# Altium schematic sheet Main_Sheet.SchDoc
size A4
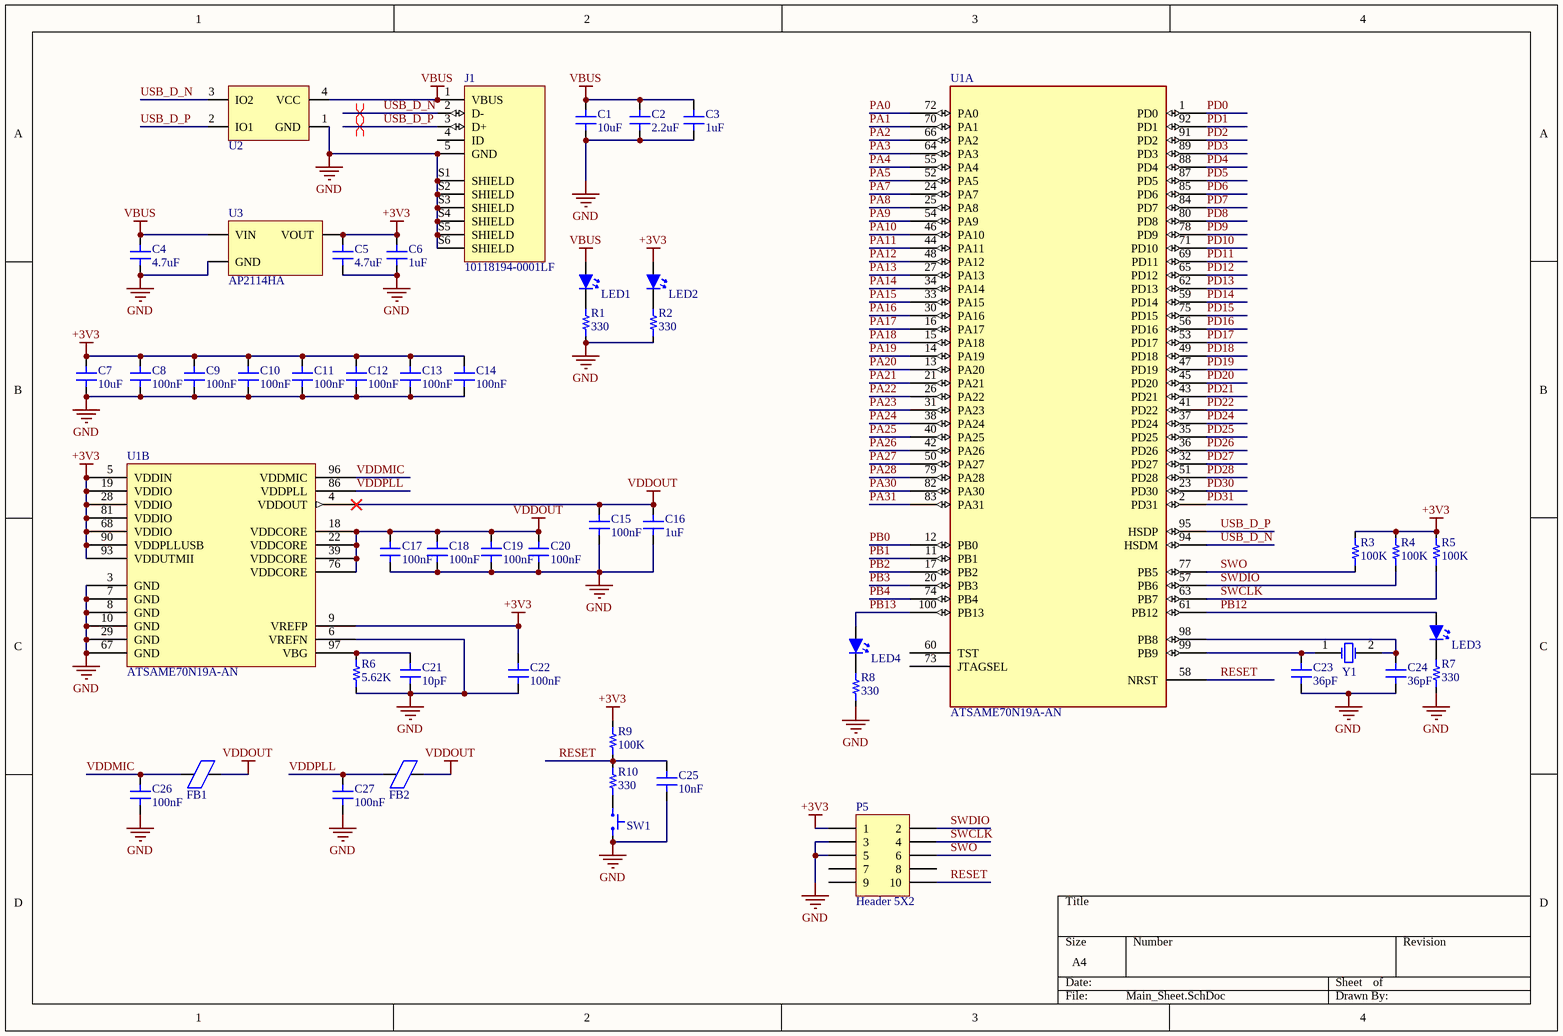
[diagram p0: Main_Sheet.SchDoc]

## Parts
C1  value 10uF  [C0603]  (hidden comment: Cap)
C2  value 2.2uF  [C0603]  (hidden comment: Cap)
C3  value 1uF  [C0603]  (hidden comment: Cap)
C4  value 4.7uF  [C0603]  (hidden comment: Cap)
C5  value 4.7uF  [C0603]  (hidden comment: Cap)
C6  value 1uF  [C0603]  (hidden comment: Cap)
C7  value 10uF  [C0603]  (hidden comment: Cap)
C8  value 100nF  [C0603]  (hidden comment: Cap)
C9  value 100nF  [C0603]  (hidden comment: Cap)
C10  value 100nF  [C0603]  (hidden comment: Cap)
C11  value 100nF  [C0603]  (hidden comment: Cap)
C12  value 100nF  [C0603]  (hidden comment: Cap)
C13  value 100nF  [C0603]  (hidden comment: Cap)
C14  value 100nF  [C0603]  (hidden comment: Cap)
C15  value 100nF  [C0603]  (hidden comment: Cap)
C16  value 1uF  [C0603]  (hidden comment: Cap)
C17  value 100nF  [C0603]  (hidden comment: Cap)
C18  value 100nF  [C0603]  (hidden comment: Cap)
C19  value 100nF  [C0603]  (hidden comment: Cap)
C20  value 100nF  [C0603]  (hidden comment: Cap)
C21  value 10pF  [C0603]  (hidden comment: Cap)
C22  value 100nF  [C0603]  (hidden comment: Cap)
C23  value 36pF  [C0603]  (hidden comment: Cap)
C24  value 36pF  [C0603]  (hidden comment: Cap)
C25  value 10nF  [C0603]  (hidden comment: Cap)
C26  value 100nF  [C0603]  (hidden comment: Cap)
C27  value 100nF  [C0603]  (hidden comment: Cap)
FB1  Ferrite Bead  [C0603]  (value not drawn)
FB2  Ferrite Bead  [C0603]  (value not drawn)
J1  10118194-0001LF  [AMPHENOL_10118194-0001LF]
LED1  LED  [LED0805]  (value not drawn)
LED2  LED  [LED0805]  (value not drawn)
LED3  LED  [LED0805]  (value not drawn)
LED4  LED  [LED0805]  (value not drawn)
P5  Header 5X2  [IPC_5X2_1.27MM]
R1  value 330  [R0603]  (hidden comment: Res)
R2  value 330  [R0603]  (hidden comment: Res)
R3  value 100K  [R0603]  (hidden comment: Res)
R4  value 100K  [R0603]  (hidden comment: Res)
R5  value 100K  [R0603]  (hidden comment: Res)
R6  value 5.62K  [R0603]  (hidden comment: Res)
R7  value 330  [R0603]  (hidden comment: Res)
R8  value 330  [R0603]  (hidden comment: Res)
R9  value 100K  [R0603]  (hidden comment: Res)
R10  value 330  [R0603]  (hidden comment: Res)
SW1  Button  [TL3305]  (value not drawn)
U1  ATSAME70N19A-AN  [TQFP100_14x14MC_MCH]  (parts A,B of 2)
U2  5.5V TVS Diode  [SOT143]  (value not drawn)
U3  AP2114HA  [SOT230P700X180-4N]
Y1  XTAL  [SMD-4]  (value not drawn)

## Nets
+3V3: C5.1 C6.1 C7.2 C8.2 C9.2 C10.2 C11.2 C12.2 C13.2 C14.2 C22.1 LED2.1(A) P5.1 R3.1 R4.1 R5.1 R9.1 U1.5(VDDIN) U1.9(VREFP) U1.19(VDDIO) U1.28(VDDIO) U1.68(VDDIO) U1.81(VDDIO) U1.90(VDDPLLUSB) U1.93(VDDUTMII) U3.3(VOUT)
GND: C1.2 C2.2 C3.2 C4.2 C5.2 C6.2 C7.1 C8.1 C9.1 C10.1 C11.1 C12.1 C13.1 C14.1 C15.2 C16.2 C17.2 C18.2 C19.2 C20.2 C21.2 C22.2 C23.1 C24.1 C25.2 C26.1 C27.1 J1.5(GND) J1.S1(SHIELD) J1.S2(SHIELD) J1.S3(SHIELD) J1.S4(SHIELD) J1.S5(SHIELD) J1.S6(SHIELD) P5.3 P5.5 R1.2 R2.2 R6.2 R7.2 R8.2 SW1.1 U1.3(GND) U1.6(VREFN) U1.7(GND) U1.8(GND) U1.10(GND) U1.29(GND) U1.67(GND) U2.1(GND) U3.2(GND)
VBUS: C1.1 C2.1 C3.1 C4.1 J1.1(VBUS) LED1.1(A) U2.4(VCC) U3.1(VIN)
VDDOUT: C15.1 C16.1 C17.1 C18.1 C19.1 C20.1 FB1.2 FB2.2 U1.4(VDDOUT) U1.18(VDDCORE) U1.22(VDDCORE) U1.39(VDDCORE) U1.76(VDDCORE)
PA0: U1.72(PA0)
PA1: U1.70(PA1)
PA2: U1.66(PA2)
PA3: U1.64(PA3)
PA4: U1.55(PA4)
PA5: U1.52(PA5)
PA7: U1.24(PA7)
PA8: U1.25(PA8)
PA9: U1.54(PA9)
PA10: U1.46(PA10)
PA11: U1.44(PA11)
PA12: U1.48(PA12)
PA13: U1.27(PA13)
PA14: U1.34(PA14)
PA15: U1.33(PA15)
PA16: U1.30(PA16)
PA17: U1.16(PA17)
PA18: U1.15(PA18)
PA19: U1.14(PA19)
PA20: U1.13(PA20)
PA21: U1.21(PA21)
PA22: U1.26(PA22)
PA23: U1.31(PA23)
PA24: U1.38(PA24)
PA25: U1.40(PA25)
PA26: U1.42(PA26)
PA27: U1.50(PA27)
PA28: U1.79(PA28)
PA30: U1.82(PA30)
PA31: U1.83(PA31)
PB0: U1.12(PB0)
PB1: U1.11(PB1)
PB2: U1.17(PB2)
PB3: U1.20(PB3)
PB4: U1.74(PB4)
PB12: LED3.1(A) U1.61(PB12)
PB13: LED4.1(A) U1.100(PB13)
PD0: U1.1(PD0)
PD1: U1.92(PD1)
PD2: U1.91(PD2)
PD3: U1.89(PD3)
PD4: U1.88(PD4)
PD5: U1.87(PD5)
PD6: U1.85(PD6)
PD7: U1.84(PD7)
PD8: U1.80(PD8)
PD9: U1.78(PD9)
PD10: U1.71(PD10)
PD11: U1.69(PD11)
PD12: U1.65(PD12)
PD13: U1.62(PD13)
PD14: U1.59(PD14)
PD15: U1.75(PD15)
PD16: U1.56(PD16)
PD17: U1.53(PD17)
PD18: U1.49(PD18)
PD19: U1.47(PD19)
PD20: U1.45(PD20)
PD21: U1.43(PD21)
PD22: U1.41(PD22)
PD24: U1.37(PD24)
PD25: U1.35(PD25)
PD26: U1.36(PD26)
PD27: U1.32(PD27)
PD28: U1.51(PD28)
PD30: U1.23(PD30)
PD31: U1.2(PD31)
RESET: C25.1 P5.10 R9.2 R10.1 U1.58(NRST)
SWCLK: P5.4 R5.2 U1.63(PB7)
SWDIO: P5.2 R4.2 U1.57(PB6)
SWO: P5.6 R3.2 U1.77(PB5)
USB_D_N: J1.2(D-) U1.94(HSDM) U2.3(IO2)
USB_D_P: J1.3(D+) U1.95(HSDP) U2.2(IO1)
VDDMIC: C26.2 FB1.1 U1.96(VDDMIC)
VDDPLL: C27.2 FB2.1 U1.86(VDDPLL)
NetC21_1: C21.1 R6.1 U1.97(VBG)
NetC23_2: C23.2 U1.99(PB9) Y1.1(OSC1)
NetC24_2: C24.2 U1.98(PB8) Y1.2(OSC2)
NetLED1_2: LED1.2(K) R1.1
NetLED2_2: LED2.2(K) R2.1
NetLED3_2: LED3.2(K) R7.1
NetLED4_2: LED4.2(K) R8.1
NetR10_2: R10.2 SW1.2

Not connected (* = marked no-connect by the designer): J1 4(ID); P5 7 8 9; U1 60(TST) 73(JTAGSEL)

## Layout directives
differential pair: USB_D_N, USB_D_P

## Library data of the parts
FB2 = Ferrite Bead: BLM18PG471SN1D
J1 = 10118194-0001LF: USB - micro B USB 2.0 Receptacle Connector 5 Position Surface Mount, Right Angle; Through Hole; MF: Amphenol ICC; Package: None; Price: None; Availability: Unavailable; MP: 10118194-0001LF; SnapEDA_Link: https://www.snapeda.com/parts/10118194-0001LF/Amphenol%20FCI/view-part/1413308/?ref=snap; Value: *
P5 = Header 5X2: Header, 5-Pin, Dual row; LatestRevisionDate: 17-Jul-2002; LatestRevisionNote: Re-released for DXP Platform.; Publisher: Altium Limited
SW1 = Button: Push Button
U1 = ATSAME70N19A-AN: No Description Available; Vendor: Microchip; Built_By: EMA_Molly; SourceLibrary: Microchip_2019-08-23_25; Manufacturer_Part_Number: ATSAME70N19A-AN; Copyright: Copyright (C) 2018 Accelerated Designs. All rights reserved; RefDes: RefDes; Type: DEV
U2 = PRTR5V0U2X
U3 = AP2114HA: 3.3V LDO; pin to pad: 3>3+4
Y1 = XTAL: ECS-120-10-33B-CKM-TR; pin to pad: 2>3; Published: 8-Jun-2000; LatestRevisionDate: 17-Jul-2002; LatestRevisionNote: Re-released for DXP Platform.; PackageReference: R38; Publisher: Altium Limited; PackageDescription: Crystal, Thru-Hole; 2 Leads; Body 3.1 x 8.2 mm (Dia.xH)